# Altium project PCB_Project.PrjPCB
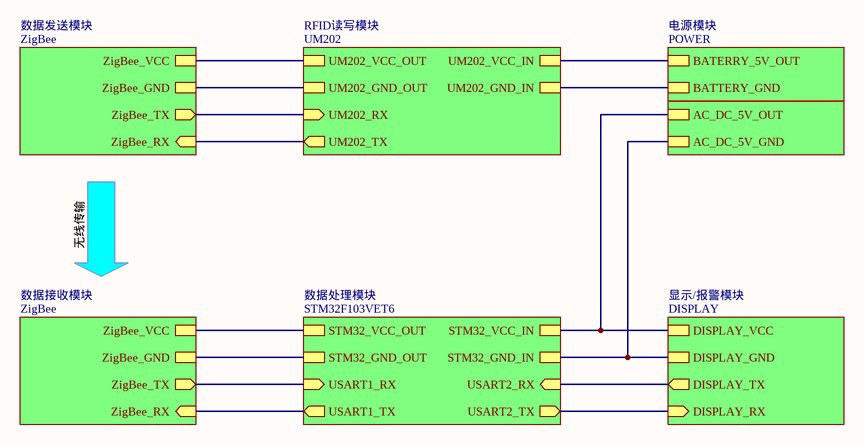
[diagram p0: MainSheet.SchDoc]
6 sheets, 141 parts. Net scope: hierarchical (ports join the sheet entries above them; power ports are global).
Sheets:
  MainSheet.SchDoc
    数据接收模块 = ZigBee.SchDoc
    数据处理模块 = STM32F103VET6.SchDoc
    显示/报警模块 = DISPLAY.SchDoc
    RFID读写模块 = UM202.SchDoc
    数据发送模块 = ZigBee.SchDoc
    电源模块 = POWER.SchDoc

## Sheet MainSheet.SchDoc
size A4

### Sub-sheets
RFID读写模块 = UM202: UM202_RX (in), UM202_TX (out), UM202_VCC_OUT, UM202_GND_OUT, UM202_VCC_IN, UM202_GND_IN
数据发送模块 = ZigBee: ZigBee_TX (out), ZigBee_RX (in), ZigBee_VCC, ZigBee_GND
数据处理模块 = STM32F103VET6: USART1_TX (out), USART1_RX (in), USART2_TX (out), USART2_RX (in), STM32_VCC_IN, STM32_GND_IN, STM32_VCC_OUT, STM32_GND_OUT
数据接收模块 = ZigBee: ZigBee_TX (out), ZigBee_RX (in), ZigBee_VCC, ZigBee_GND
显示/报警模块 = DISPLAY: DISPLAY_TX (out), DISPLAY_RX (in), DISPLAY_VCC, DISPLAY_GND
电源模块 = POWER: AC_DC_5V_OUT, BATERRY_5V_OUT, AC_DC_5V_GND, BATTERY_GND

### Nets
+5: sheet 数据接收模块/ZigBee_VCC, sheet 数据处理模块/STM32_VCC_IN, sheet 数据处理模块/STM32_VCC_OUT, sheet 显示/报警模块/DISPLAY_VCC, sheet RFID读写模块/UM202_VCC_OUT, sheet RFID读写模块/UM202_VCC_IN, sheet 数据发送模块/ZigBee_VCC, sheet 电源模块/AC_DC_5V_OUT, sheet 电源模块/BATERRY_5V_OUT
DISPLAY_GND: sheet 数据接收模块/ZigBee_GND, sheet 数据处理模块/STM32_GND_IN, sheet 数据处理模块/STM32_GND_OUT, sheet 显示/报警模块/DISPLAY_GND, sheet RFID读写模块/UM202_GND_OUT, sheet RFID读写模块/UM202_GND_IN, sheet 数据发送模块/ZigBee_GND, sheet 电源模块/AC_DC_5V_GND, sheet 电源模块/BATTERY_GND
\: sheet 数据接收模块/ZigBee_TX, sheet 数据处理模块/USART1_RX
\: sheet RFID读写模块/UM202_RX, sheet 数据发送模块/ZigBee_TX  [a separate net that carries the same name]
RX: sheet 数据接收模块/ZigBee_RX, sheet 数据处理模块/USART1_TX
RX: sheet RFID读写模块/UM202_TX, sheet 数据发送模块/ZigBee_RX  [a separate net that carries the same name]
NetDisplay_4: sheet 数据处理模块/USART2_RX, sheet 显示/报警模块/DISPLAY_TX
NetDisplay_5: sheet 数据处理模块/USART2_TX, sheet 显示/报警模块/DISPLAY_RX

### Notes on the sheet
- 无线传输

## Sheet ZigBee.SchDoc
size A4
Used 2 times, as channels 数据接收模块, 数据发送模块. Parts and nets are listed once, with the designators drawn on the sheet.
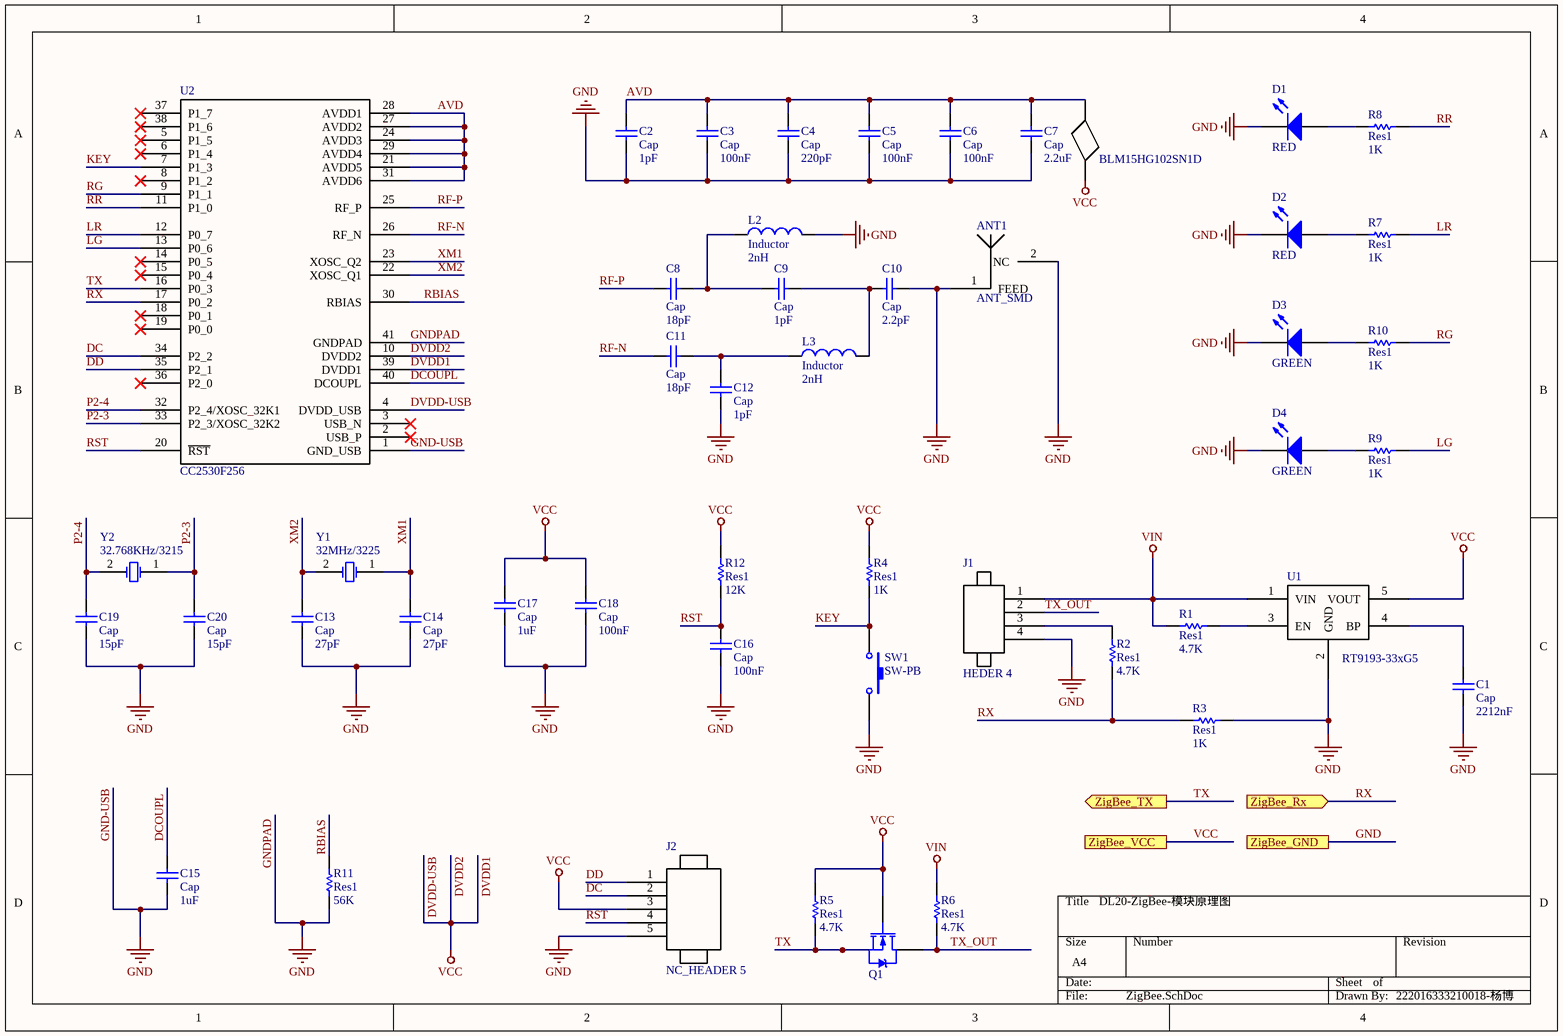
[diagram p1: ZigBee.SchDoc]

### Parts
ANT1  ANT_SMD
BLM  BLM15HG102SN1D
C1  Cap  value 2212nF  [RAD-0.3]
C2  Cap  value 1pF  [RAD-0.3]
C3  Cap  value 100nF  [RAD-0.3]
C4  Cap  value 220pF  [RAD-0.3]
C5  Cap  value 100nF  [RAD-0.3]
C6  Cap  value 100nF  [RAD-0.3]
C7  Cap  value 2.2uF  [RAD-0.3]
C8  Cap  value 18pF  [RAD-0.3]
C9  Cap  value 1pF  [RAD-0.3]
C10  Cap  value 2.2pF  [RAD-0.3]
C11  Cap  value 18pF  [RAD-0.3]
C12  Cap  value 1pF  [RAD-0.3]
C13  Cap  value 27pF  [RAD-0.3]
C14  Cap  value 27pF  [RAD-0.3]
C15  Cap  value 1uF  [RAD-0.3]
C16  Cap  value 100nF  [RAD-0.3]
C17  Cap  value 1uF  [RAD-0.3]
C18  Cap  value 100nF  [RAD-0.3]
C19  Cap  value 15pF  [RAD-0.3]
C20  Cap  value 15pF  [RAD-0.3]
D1  RED  [LED-0]
D2  RED  [LED-0]
D3  GREEN  [LED-0]
D4  GREEN  [LED-0]
J1  HEDER 4
J2  NC_HEADER 5
L2  Inductor  value 2nH  [0402-A]
L3  Inductor  value 2nH  [0402-A]
Q1  NMOS-2  [TO-220AB]  (value not drawn)
R1  Res1  value 4.7K  [AXIAL-0.3]
R2  Res1  value 4.7K  [AXIAL-0.3]
R3  Res1  value 1K  [AXIAL-0.3]
R4  Res1  value 1K  [AXIAL-0.3]
R5  Res1  value 4.7K  [AXIAL-0.3]
R6  Res1  value 4.7K  [AXIAL-0.3]
R7  Res1  value 1K  [AXIAL-0.3]
R8  Res1  value 1K  [AXIAL-0.3]
R9  Res1  value 1K  [AXIAL-0.3]
R10  Res1  value 1K  [AXIAL-0.3]
R11  Res1  value 56K  [AXIAL-0.3]
R12  Res1  value 12K  [AXIAL-0.3]
SW1  SW-PB  [SPST-2]
U1  RT9193-33xG5
U2  CC2530F256
Y1  32MHz/3225  [R38]
Y2  32.768KHz/3215  [R38]

### Ports
ZigBee_GND, ZigBee_Rx (in), ZigBee_TX (out), ZigBee_VCC

### Nets
DVDD-USB: BLM.7 C17.2 C18.2 J2.3 Q1.1(G) R4.2 R5.2 R12.2 U1.5(VOUT) U2.4(DVDD_USB) U2.10(DVDD2) U2.39(DVDD1) ; port ZigBee_VCC  [also labelled DVDD1, DVDD2, VCC]
GND: ANT1.1(FEED) ANT1.2(NC) C1.1 C2.1 C3.1 C4.1 C5.1 C6.1 C7.1 C10.2 C12.2 C13.1 C14.1 C15.1 C16.1 C17.1 C18.1 C19.1 C20.1 D1.2(K) D2.2(K) D3.2(K) D4.2(K) J1.4 J2.5 L2.2 R3.1 R11.1 SW1.2 U1.2(GND) U2.1(GND_USB) U2.41(GNDPAD) ; port ZigBee_GND  [also labelled GND-USB, GNDPAD]
VIN: J1.1 R1.2 R6.2 U1.1(VIN)
\: Q1.3(S) R5.1 R10.1 U2.9(P1_1) U2.16(P0_3) ; port ZigBee_TX  [also labelled RG, TX]
AVD: BLM.6 C2.2 C3.2 C4.2 C5.2 C6.2 C7.2 U2.21(AVDD5) U2.24(AVDD3) U2.27(AVDD2) U2.28(AVDD1) U2.29(AVDD4) U2.31(AVDD6)
DC: J2.2 U2.34(P2_2)
DCOUPL: C15.2 U2.40(DCOUPL)
DD: J2.1 U2.35(P2_1)
KEY: R4.1 SW1.1 U2.7(P1_3)
LG: R9.1 U2.13(P0_6)
LR: R7.1 U2.12(P0_7)
P2-3: C20.2 U2.33(P2_3/XOSC_32K2) Y2.1(OSC1)
P2-4: C19.2 U2.32(P2_4/XOSC_32K1) Y2.2(OSC2)
RBIAS: R11.2 U2.30(RBIAS)
RF-N: C11.1 U2.26(RF_N)
RF-P: C8.1 U2.25(RF_P)
RR: R8.1 U2.11(P1_0)
RST: C16.2 J2.4 R12.1 U2.20(~{RST})
RX: R2.1 R3.2 U2.17(P0_2) ; port ZigBee_Rx
TX_OUT: J1.2 Q1.2(D) R6.1
XM1: C14.2 U2.23(XOSC_Q2) Y1.1(OSC1)
XM2: C13.2 U2.22(XOSC_Q1) Y1.2(OSC2)
NetC1_2: C1.2 U1.4(BP)
NetC8_2: C8.2 C9.1 L2.1
NetC9_2: C9.2 C10.1 L3.2
NetC11_2: C11.2 C12.1 L3.1
NetD1_1: D1.1(A) R8.2
NetD2_1: D2.1(A) R7.2
NetD3_1: D3.1(A) R10.2
NetD4_1: D4.1(A) R9.2
NetJ1_3: J1.3 R2.2
NetR1_1: R1.1 U1.3(EN)

Not connected (* = marked no-connect by the designer): U2 2(USB_P)* 3(USB_N)* 5(P1_5)* 6(P1_4)* 8(P1_2)* 14(P0_5)* 15(P0_4)* 18(P0_1)* 19(P0_0)* 36(P2_0)* 37(P1_7)* 38(P1_6)*

### Channels
数据接收模块: designators end in _数据接收模块; ports ZigBee_GND=DISPLAY_GND ZigBee_Rx=RX ZigBee_TX=\ ZigBee_VCC=+5
数据发送模块: designators end in _数据发送模块; ports ZigBee_GND=DISPLAY_GND ZigBee_Rx=RX ZigBee_TX=\ ZigBee_VCC=+5

### Notes on the sheet
- DL20-ZigBee-模块原理图
- 222016333210018-杨博

### Library data of the parts
C1-C20 = Cap: Capacitor; Published: 8-Jun-2000; LatestRevisionDate: 17-Jul-2002; LatestRevisionNote: Re-released for DXP Platform.; PackageReference: RAD-0.3; Publisher: Altium Limited; PackageDescription: Radial Cap, Thru-Hole; 2 Leads; 0.3 in Pin Spacing
D1-D4 = LED0: Typical INFRARED GaAs LED; Published: 8-Jun-2000; LatestRevisionDate: 08-Jul-2005; LatestRevisionNote: Mech Layer 1 removed.; PackageReference: LED-0; Publisher: Altium Limited; PackageDescription: LED; 2 Leads
L2 L3 = Inductor: Code_IEC: 1005; Published: 8-Jun-2000; LatestRevisionDate: 29-May-2009; LatestRevisionNote: IPC-7351 Footprint Added.; PackageReference: 0402-A; Publisher: Altium Limited; PackageDescription: Chip Inductor; Code_JEITA: 0402
Q1 = NMOS-2: N-Channel Power MOSFET; Note: Pin 2 is electrically connected to pin 4.; Published: 8-Jun-2000; LatestRevisionDate: 17-Jul-2002; LatestRevisionNote: Re-released for DXP Platform.; DatasheetVersion: PD-9.814; PackageVersion: Feb-1997; PackageReference: TO-220AB; Publisher: Altium Limited; PackageDescription: TO, Thru-Hole, Vertical, Heatsink Mounted; 3 In-Line Leads; Pitch 2.54 mm; ComponentLink1Description: Manufacturer Link; ComponentLink1URL: http://www.irf.com/
R1-R12 = Res1: Resistor; Published: 8-Jun-2000; LatestRevisionDate: 17-Jul-2002; LatestRevisionNote: Re-released for DXP Platform.; PackageReference: AXIAL-0.3; Publisher: Altium Limited; PackageDescription: Axial Device, Thru-Hole; 2 Leads; 0.3 in Pin Spacing
SW1 = SW-PB: Switch; Published: 24-Mar-1999; LatestRevisionDate: 17-Jul-2002; LatestRevisionNote: Re-released for DXP Platform.; PackageReference: SPST-2; Publisher: Altium Limited; PackageDescription: Switch; 2 Leads
Y1 Y2 = XTAL: Crystal Oscillator; Published: 8-Jun-2000; LatestRevisionDate: 17-Jul-2002; LatestRevisionNote: Re-released for DXP Platform.; PackageReference: R38; Publisher: Altium Limited; PackageDescription: Crystal, Thru-Hole; 2 Leads; Body 3.1 x 8.2 mm (Dia.xH)

## Sheet STM32F103VET6.SchDoc
size A4
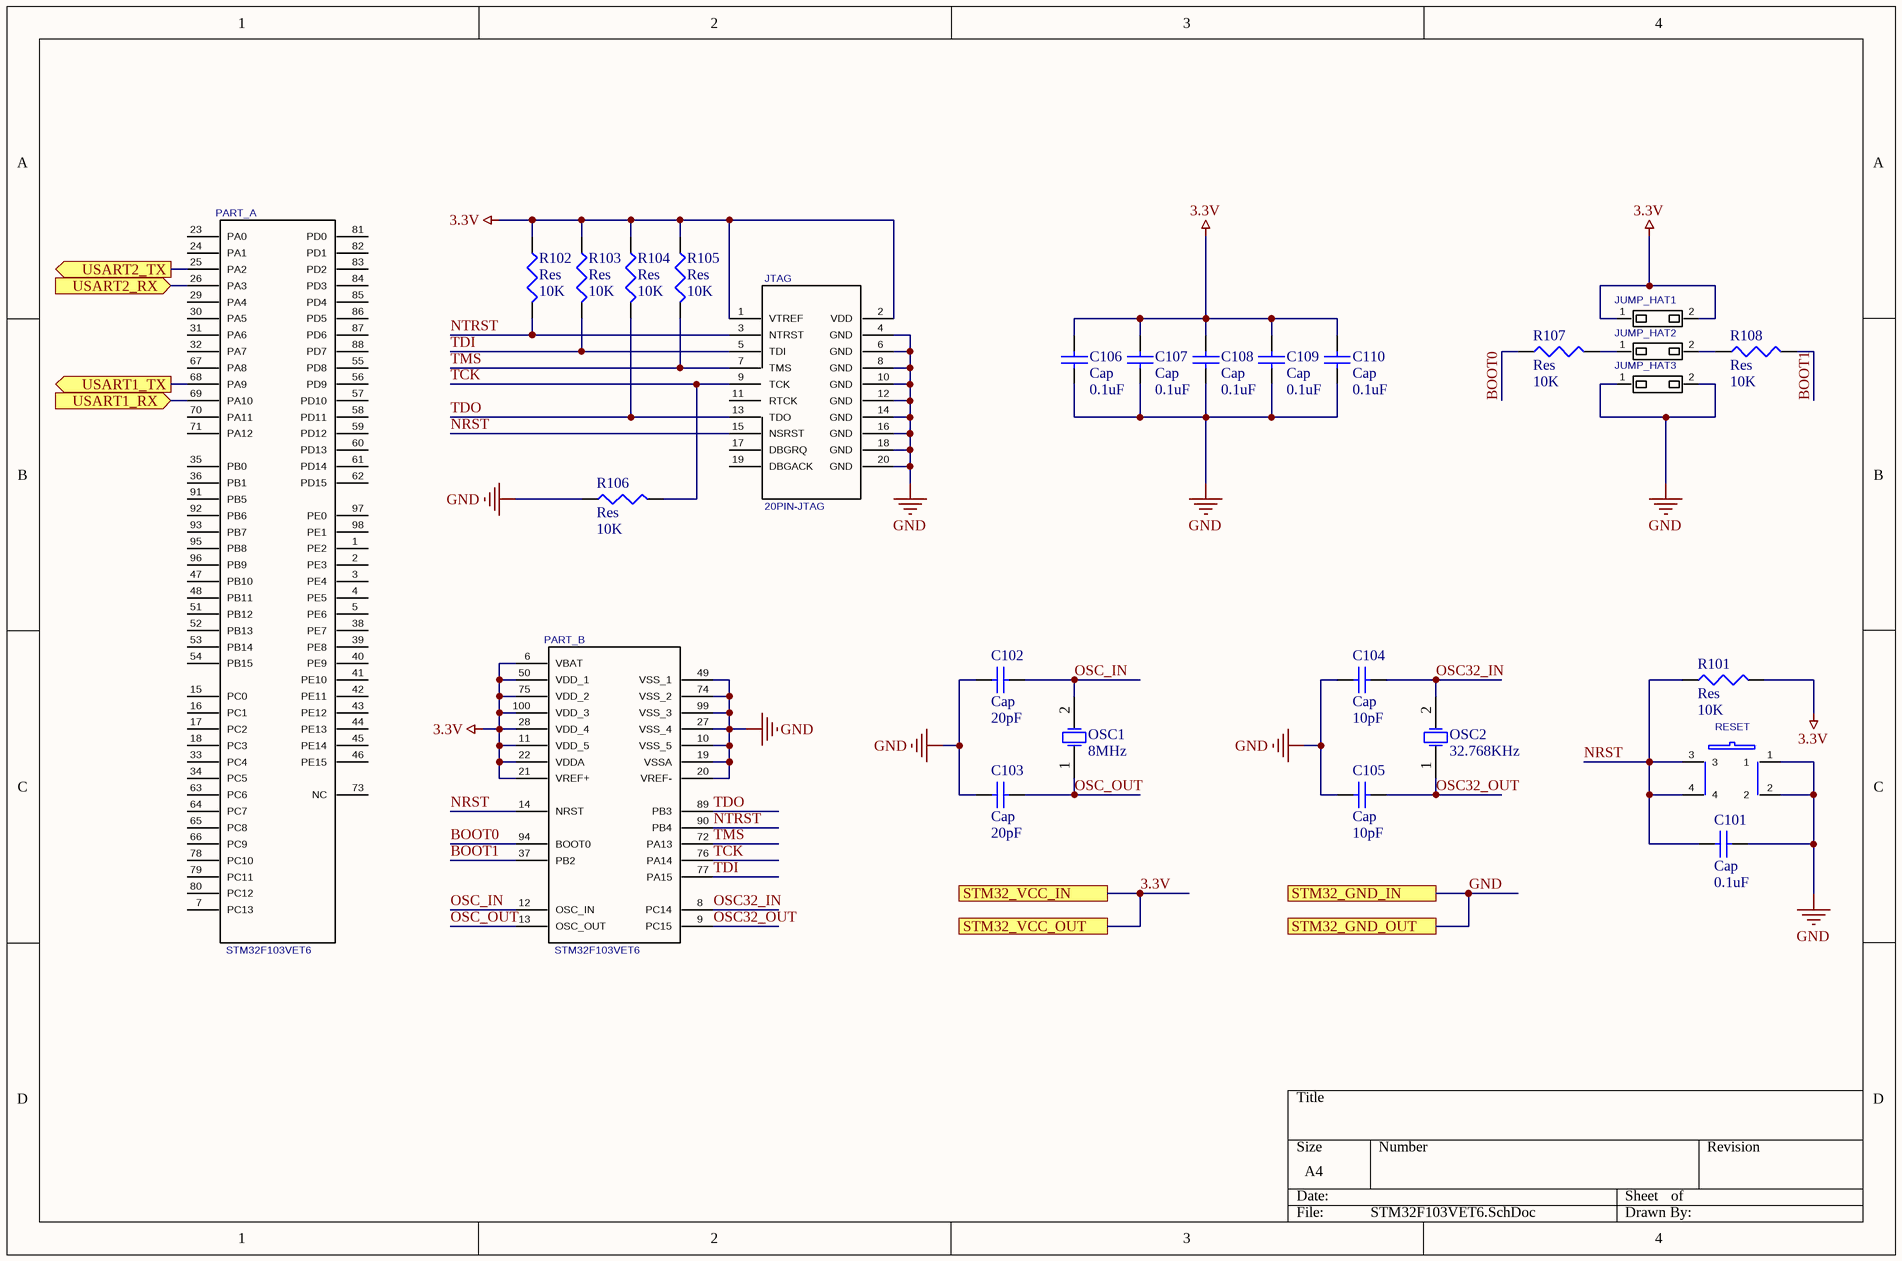
[diagram p2: STM32F103VET6.SchDoc]

### Parts
C101  Cap  value 0.1uF  [RAD-0.3]
C102  Cap  value 20pF  [RAD-0.3]
C103  Cap  value 20pF  [RAD-0.3]
C104  Cap  value 10pF  [RAD-0.3]
C105  Cap  value 10pF  [RAD-0.3]
C106  Cap  value 0.1uF  [RAD-0.3]
C107  Cap  value 0.1uF  [RAD-0.3]
C108  Cap  value 0.1uF  [RAD-0.3]
C109  Cap  value 0.1uF  [RAD-0.3]
C110  Cap  value 0.1uF  [RAD-0.3]
JTAG  20PIN-JTAG  [FC20H]
JUMP_HAT1  1X2PIN_SMD  [1X2PIN_SMD]  (value not drawn)
JUMP_HAT2  1X2PIN_SMD  [1X2PIN_SMD]  (value not drawn)
JUMP_HAT3  1X2PIN_SMD  [1X2PIN_SMD]  (value not drawn)
OSC1  8MHz  [R38]
OSC2  32.768KHz  [R38]
PART_  STM32F103VET6  [STM32F103VET6-LQFP]  (parts A,B of 2)
R101  Res  value 10K  [J1-0603]
R102  Res  value 10K  [J1-0603]
R103  Res  value 10K  [J1-0603]
R104  Res  value 10K  [J1-0603]
R105  Res  value 10K  [J1-0603]
R106  Res  value 10K  [J1-0603]
R107  Res  value 10K  [J1-0603]
R108  Res  value 10K  [J1-0603]
RESET  KEY  [SW6.2/6.2-SMD]  (value not drawn)

### Ports
STM32_GND_IN, STM32_GND_OUT, STM32_VCC_IN, STM32_VCC_OUT, USART1_RX (in), USART1_TX (out), USART2_RX (in), USART2_TX (out)

### Nets
3.3V: C106.2 C107.2 C108.2 C109.2 C110.2 JTAG.1(VTREF) JTAG.2(VDD) JUMP_HAT1.1 JUMP_HAT1.2 PART_.6(VBAT) PART_.11(VDD_5) PART_.21(VREF+) PART_.22(VDDA) PART_.28(VDD_4) PART_.50(VDD_1) PART_.75(VDD_2) PART_.100(VDD_3) R101.2 R102.1 R103.1 R104.1 R105.1 ; port STM32_VCC_IN, port STM32_VCC_OUT  [project net +5]
GND: C101.2 C102.1 C103.1 C104.1 C105.1 C106.1 C107.1 C108.1 C109.1 C110.1 JTAG.4(GND) JTAG.6(GND) JTAG.8(GND) JTAG.10(GND) JTAG.12(GND) JTAG.14(GND) JTAG.16(GND) JTAG.18(GND) JTAG.20(GND) JUMP_HAT3.1 JUMP_HAT3.2 PART_.10(VSS_5) PART_.19(VSSA) PART_.20(VREF-) PART_.27(VSS_4) PART_.49(VSS_1) PART_.74(VSS_2) PART_.99(VSS_3) R106.1 RESET.1 RESET.2 ; port STM32_GND_IN, port STM32_GND_OUT  [project net DISPLAY_GND]
\: PART_.69(PA10) ; port USART1_RX
BOOT0: PART_.94(BOOT0) R107.1
BOOT1: PART_.37(PB2) R108.1
NRST: C101.1 JTAG.15(NSRST) PART_.14(NRST) R101.1 RESET.3 RESET.4
NTRST: JTAG.3(NTRST) PART_.90(PB4) R102.2
OSC32_IN: C104.2 OSC2.2(OSC2) PART_.8(PC14)
OSC32_OUT: C105.2 OSC2.1(OSC1) PART_.9(PC15)
OSC_IN: C102.2 OSC1.2(OSC2) PART_.12(OSC_IN)
OSC_OUT: C103.2 OSC1.1(OSC1) PART_.13(OSC_OUT)
RX: PART_.68(PA9) ; port USART1_TX
TCK: JTAG.9(TCK) PART_.76(PA14) R106.2
TDI: JTAG.5(TDI) PART_.77(PA15) R103.2
TDO: JTAG.13(TDO) PART_.89(PB3) R104.2
TMS: JTAG.7(TMS) PART_.72(PA13) R105.2
NetDisplay_4: PART_.26(PA3) ; port USART2_RX
NetDisplay_5: PART_.25(PA2) ; port USART2_TX
NetJUMP_HAT2_1: JUMP_HAT2.1 R107.2
NetJUMP_HAT2_2: JUMP_HAT2.2 R108.2

Not connected (* = marked no-connect by the designer): JTAG 11(RTCK) 17(DBGRQ) 19(DBGACK); PART_ 1(PE2) 2(PE3) 3(PE4) 4(PE5) 5(PE6) 7(PC13) 15(PC0) 16(PC1) 17(PC2) 18(PC3) 23(PA0) 24(PA1) 29(PA4) 30(PA5) 31(PA6) 32(PA7) 33(PC4) 34(PC5) 35(PB0) 36(PB1) 38(PE7) 39(PE8) 40(PE9) 41(PE10) 42(PE11) 43(PE12) 44(PE13) 45(PE14) 46(PE15) 47(PB10) 48(PB11) 51(PB12) 52(PB13) 53(PB14) 54(PB15) 55(PD8) 56(PD9) 57(PD10) 58(PD11) 59(PD12) 60(PD13) 61(PD14) 62(PD15) 63(PC6) 64(PC7) 65(PC8) 66(PC9) 67(PA8) 70(PA11) 71(PA12) 73(NC) 78(PC10) 79(PC11) 80(PC12) 81(PD0) 82(PD1) 83(PD2) 84(PD3) 85(PD4) 86(PD5) 87(PD6) 88(PD7) 91(PB5) 92(PB6) 93(PB7) 95(PB8) 96(PB9) 97(PE0) 98(PE1)

### Library data of the parts
C101-C110 = Cap: Capacitor; Published: 8-Jun-2000; LatestRevisionDate: 17-Jul-2002; LatestRevisionNote: Re-released for DXP Platform.; PackageReference: RAD-0.3; Publisher: Altium Limited; PackageDescription: Radial Cap, Thru-Hole; 2 Leads; 0.3 in Pin Spacing
JTAG = 20PIN-JTAG: 20pin JTAG; Manufacturer #1: 20pin JTAG; Manufacturer #1 PN: 20pin JTAG; Value: 20pin JTAG; PCB DECAL: FC20H
OSC1 OSC2 = XTAL: Crystal Oscillator; Published: 8-Jun-2000; LatestRevisionDate: 17-Jul-2002; LatestRevisionNote: Re-released for DXP Platform.; PackageReference: R38; Publisher: Altium Limited; PackageDescription: Crystal, Thru-Hole; 2 Leads; Body 3.1 x 8.2 mm (Dia.xH)
PART_ = STM32F103VET6: Geometry.Height: 62.99mil; Protel.FootprintDescription: TSQFP, 100-Leads, Body 16.2x16.2mm (max), Pitch 0.50mm, IP; Value: STM32F103VET6; PCB DECAL: STM32F103VET6-LQFP
R101-R108 = Res3: Resistor; Published: 8-Jun-2000; LatestRevisionDate: 29-May-2009; LatestRevisionNote: IPC-7351 Footprint Added.; PackageReference: J1-0603; Publisher: Altium Limited; PackageDescription: Chip Resistor
JUMP_HAT1-JUMP_HAT3 = 1X2PIN_SMD: PCB DECAL: 1X2PIN_SMD
RESET = KEY: Manufacturer #1 PN: KEY; PCB DECAL: SW6.2/6.2-SMD

## Sheet DISPLAY.SchDoc
size A4
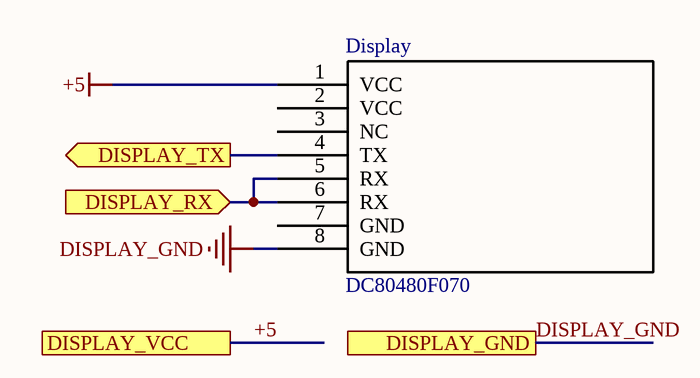
[diagram p3: DISPLAY.SchDoc]

### Parts
Display  DC80480F070

### Ports
DISPLAY_GND, DISPLAY_RX (in), DISPLAY_TX (out), DISPLAY_VCC

### Nets
+5: Display.1(VCC) ; port DISPLAY_VCC
DISPLAY_GND: Display.8(GND) ; port DISPLAY_GND
NetDisplay_4: Display.4(TX) ; port DISPLAY_TX
NetDisplay_5: Display.5(RX) Display.6(RX) ; port DISPLAY_RX

Not connected (* = marked no-connect by the designer): Display 2(VCC) 3(NC) 7(GND)

## Sheet UM202.SchDoc
size A4
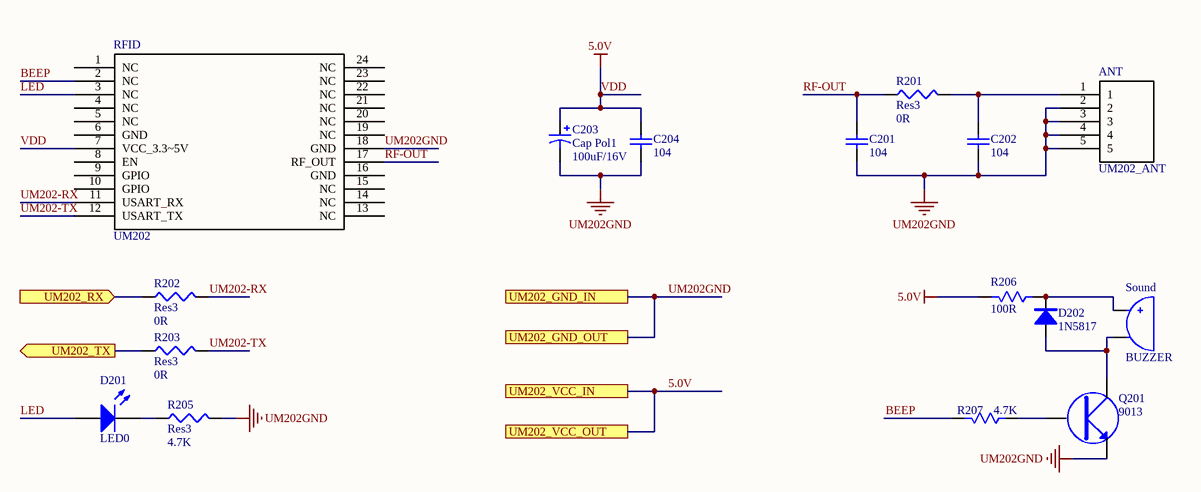
[diagram p4: UM202.SchDoc]

### Parts
ANT  UM202_ANT
C201  104  [RAD-0.3]
C202  104  [RAD-0.3]
C203  Cap Pol1  value 100uF/16V  [RB7.6-15]
C204  104  [RAD-0.3]
D201  LED0  [LED-0]
D202  1N5817  [SOD-323]
Q201  9013
R201  Res3  value 0R  [J1-0603]
R202  Res3  value 0R  [J1-0603]
R203  Res3  value 0R  [J1-0603]
R205  Res3  value 4.7K  [J1-0603]
R206  100R  [0603R-M]
R207  4.7K  [0603R-M]
RFID  UM202
Sound  BUZZER  [BUZZER-SMD]

### Ports
UM202_GND_IN, UM202_GND_OUT, UM202_RX (in), UM202_TX (out), UM202_VCC_IN, UM202_VCC_OUT

### Nets
5.0V: C203.1 C204.2 R206.1 RFID.7(VCC_3.3~5V) ; port UM202_VCC_IN, port UM202_VCC_OUT  [also labelled VDD]  [project net +5]
UM202GND: ANT.2 ANT.3 ANT.4 ANT.5 C201.1 C202.1 C203.2 C204.1 Q201.2 R205.2 RFID.18(GND) ; port UM202_GND_IN, port UM202_GND_OUT  [project net DISPLAY_GND]
\: R202.1 ; port UM202_RX
BEEP: R207.1 RFID.2(NC)
LED: D201.1(A) RFID.3(NC)
RF-OUT: C201.2 R201.1 RFID.17(RF_OUT)
RX: R203.1 ; port UM202_TX
UM202-RX: R202.2 RFID.11(USART_RX)
UM202-TX: R203.2 RFID.12(USART_TX)
NetANT_1: ANT.1 C202.2 R201.2
NetD201_2: D201.2(K) R205.1
NetD202_A: D202.A Q201.3 Sound.2(B)
NetD202_C: D202.C R206.2 Sound.1(A)
NetQ201_1: Q201.1 R207.2

Not connected (* = marked no-connect by the designer): RFID 1(NC) 4(NC) 5(NC) 6(GND) 8(EN) 9(GPIO) 10(GPIO) 13(NC) 14(NC) 15(NC) 16(GND) 19(NC) 20(NC) 21(NC) 22(NC) 23(NC) 24(NC)

### Library data of the parts
C201 C202 C204 = Cap: Capacitor; Published: 8-Jun-2000; LatestRevisionDate: 17-Jul-2002; LatestRevisionNote: Re-released for DXP Platform.; PackageReference: RAD-0.3; Publisher: Altium Limited; PackageDescription: Radial Cap, Thru-Hole; 2 Leads; 0.3 in Pin Spacing
C203 = Cap Pol1: Polarized Capacitor (Radial); Published: 8-Jun-2000; LatestRevisionDate: 17-Jul-2002; LatestRevisionNote: Re-released for DXP Platform.; PackageReference: RB7.6-15; Publisher: Altium Limited; PackageDescription: Polarized Capacitor (Radial); 2 Leads
D201 = LED0: Typical INFRARED GaAs LED; Published: 8-Jun-2000; LatestRevisionDate: 08-Jul-2005; LatestRevisionNote: Mech Layer 1 removed.; PackageReference: LED-0; Publisher: Altium Limited; PackageDescription: LED; 2 Leads
D202 = DIODE
R201-R203 R205 = Res3: Resistor; Published: 8-Jun-2000; LatestRevisionDate: 29-May-2009; LatestRevisionNote: IPC-7351 Footprint Added.; PackageReference: J1-0603; Publisher: Altium Limited; PackageDescription: Chip Resistor
R206 R207 = RES1

## Sheet POWER.SchDoc
size A4
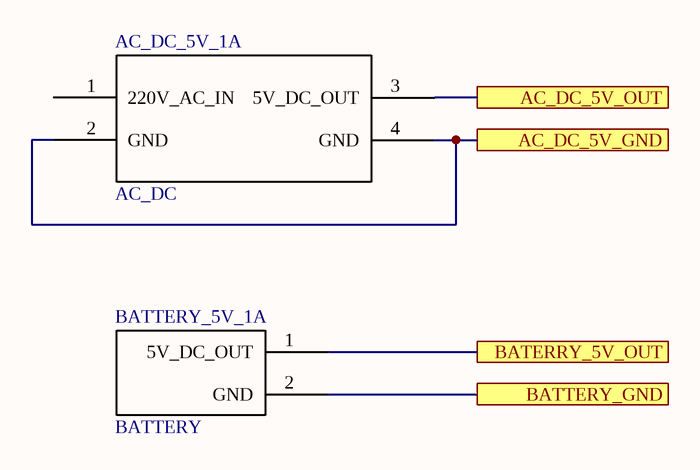
[diagram p5: POWER.SchDoc]

### Parts
AC_DC_5V_1A  AC_DC
BATTERY_5V_1A  BATTERY

### Ports
AC_DC_5V_GND, AC_DC_5V_OUT, BATERRY_5V_OUT, BATTERY_GND

### Nets
+5: AC_DC_5V_1A.3(5V_DC_OUT) BATTERY_5V_1A.1(5V_DC_OUT) ; port AC_DC_5V_OUT, port BATERRY_5V_OUT
DISPLAY_GND: AC_DC_5V_1A.2(GND) AC_DC_5V_1A.4(GND) BATTERY_5V_1A.2(GND) ; port AC_DC_5V_GND, port BATTERY_GND

Not connected (* = marked no-connect by the designer): AC_DC_5V_1A 1(220V_AC_IN)

## Nets that join several sheets
+5: 数据接收模块 (12 pins), STM32F103VET6 (22 pins), DISPLAY (Display.1), UM202 (C203.1 C204.2 R206.1 RFID.7), 数据发送模块 (12 pins), POWER (AC_DC_5V_1A.3 BATTERY_5V_1A.1)
DISPLAY_GND: 数据接收模块 (32 pins), STM32F103VET6 (31 pins), DISPLAY (Display.8), UM202 (11 pins), 数据发送模块 (32 pins), POWER (AC_DC_5V_1A.2 AC_DC_5V_1A.4 BATTERY_5V_1A.2)
VIN: 数据接收模块 (J1_数据接收模块.1 R1_数据接收模块.2 R6_数据接收模块.2 U1_数据接收模块.1), 数据发送模块 (J1_数据发送模块.1 R1_数据发送模块.2 R6_数据发送模块.2 U1_数据发送模块.1)
\: 数据接收模块 (5 pins), STM32F103VET6 (PART_.69)
\: UM202 (R202.1), 数据发送模块 (5 pins)
NetDisplay_4: STM32F103VET6 (PART_.26), DISPLAY (Display.4)
NetDisplay_5: STM32F103VET6 (PART_.25), DISPLAY (Display.5 Display.6)
RX: 数据接收模块 (R2_数据接收模块.1 R3_数据接收模块.2 U2_数据接收模块.17), STM32F103VET6 (PART_.68)
RX: UM202 (R203.1), 数据发送模块 (R2_数据发送模块.1 R3_数据发送模块.2 U2_数据发送模块.17)